# Altium schematic sheet MAX1104_TOP.SCHDOC
size B; Organization: Altium Limited; Address1: L3, 12a Rodborough Rd; Address2: Frenchs Forest; Address3: NSW; Address4: Australia 2086; DocumentNumber: 1; SheetNumber: 1; SheetTotal: 1
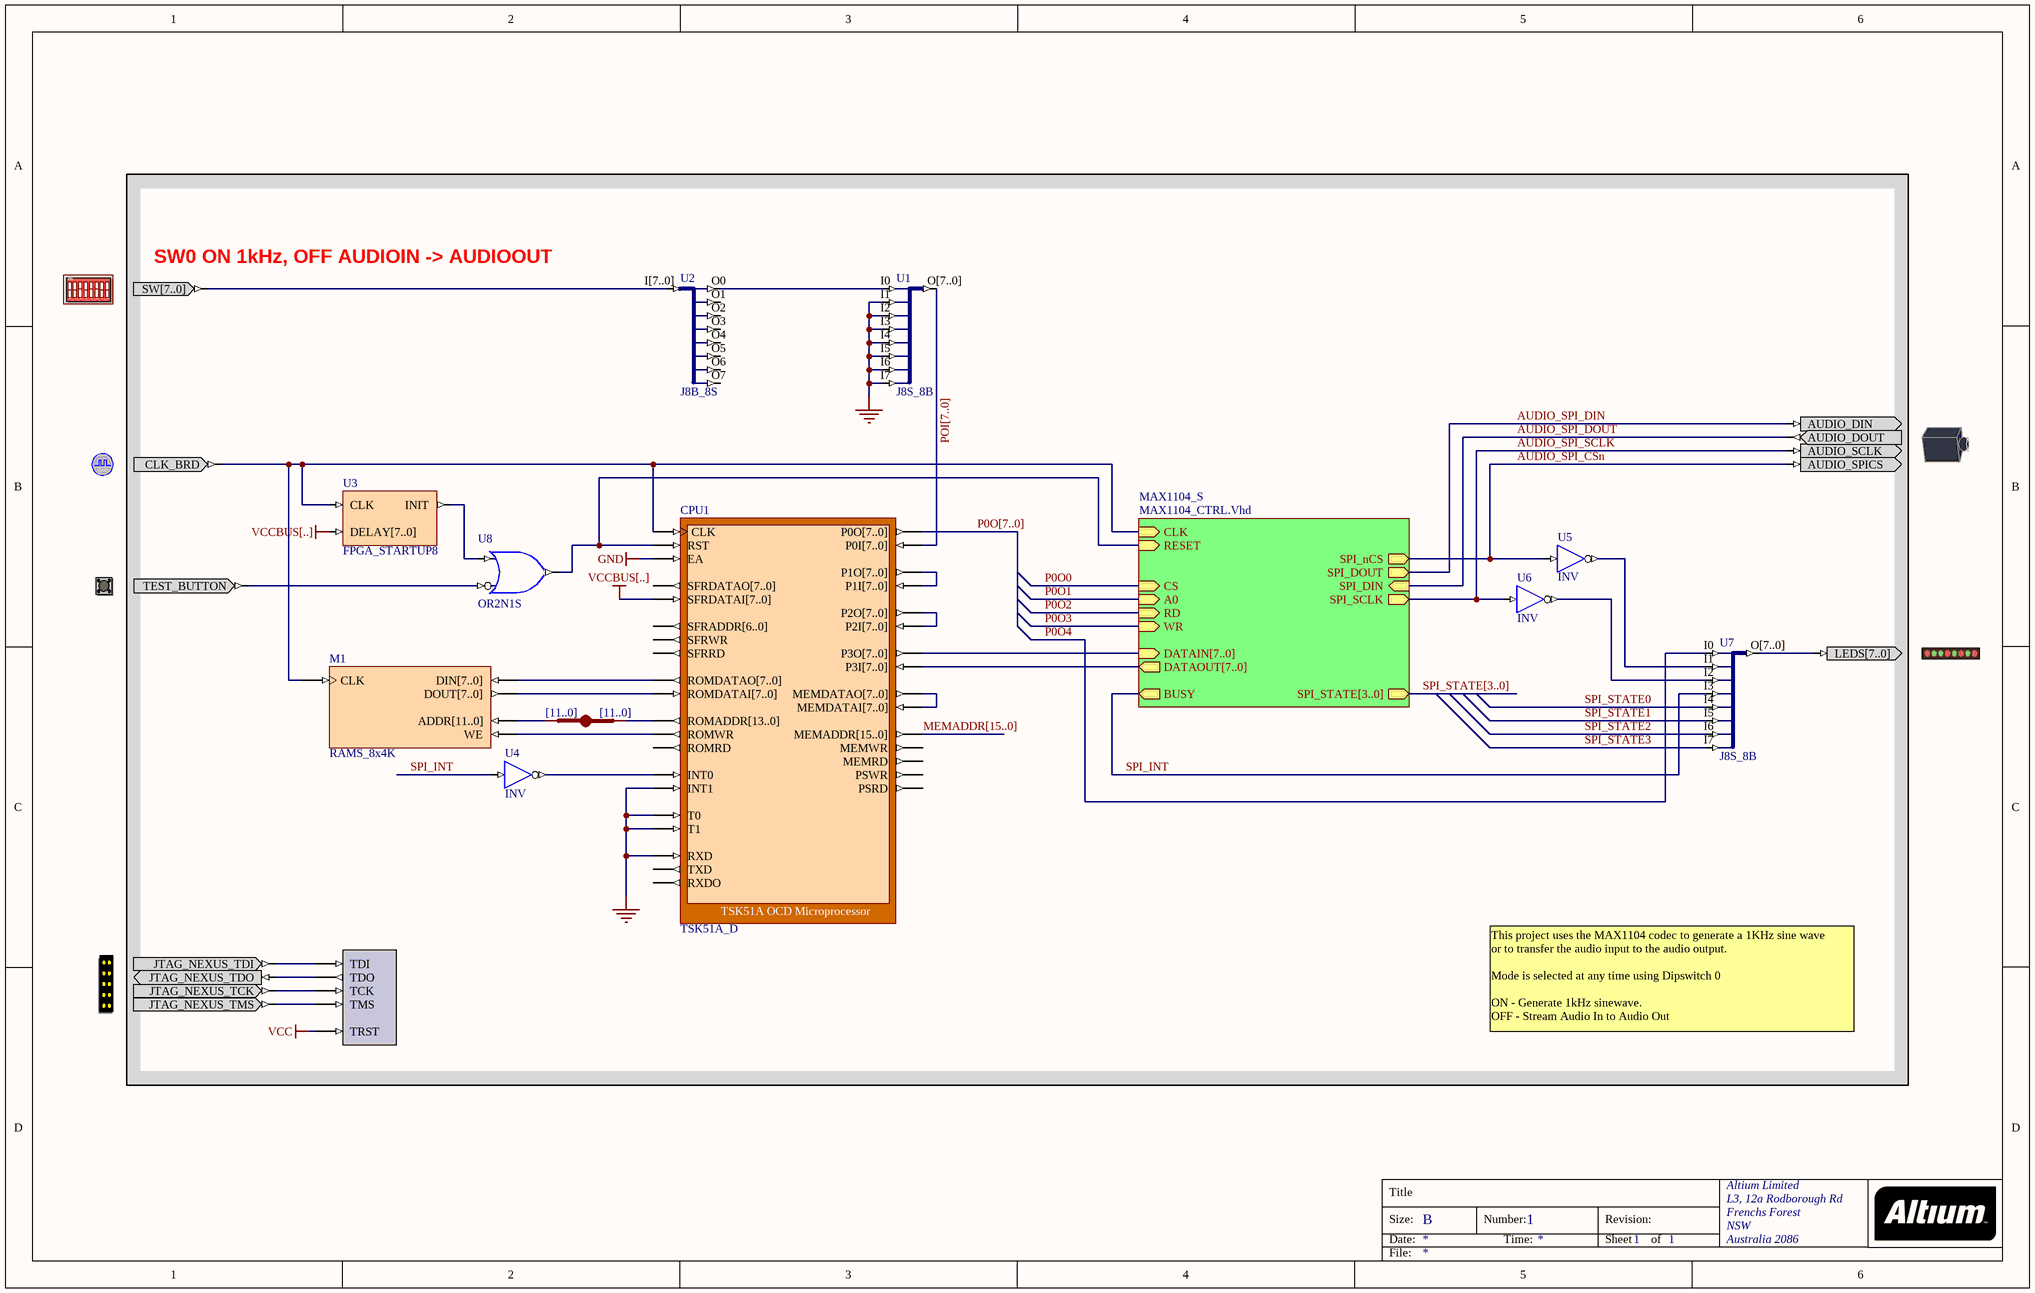
[diagram p0: MAX1104_TOP.SCHDOC]

## Parts
(Parts that share a designator on the sheet are numbered #1, #2 ... from top to bottom, then left to right.)
?#1  DIPSWITCH  (value not drawn)
?#2  CLOCK_BOARD  (value not drawn)
?#3  AUDIO_DAC  (value not drawn)
?#4  TEST_BUTTON  (value not drawn)
?#5  LED  (value not drawn)
?#6  NEXUS_JTAG_CONNECTOR  (value not drawn)
CPU1  TSK51A_D
M1  RAMS_8x4K
NEXUS_JTAG_PORT  NEXUS_JTAG_PORT  (value not drawn)
U1  J8S_8B
U2  J8B_8S
U3  FPGA_STARTUP8
U4  INV
U5  INV
U6  INV
U7  J8S_8B
U8  OR2N1S
U101  IndexA: [11..0]  (hidden comment: JB)

## Blocks framed on the sheet
SW0 ON 1kHz, OFF AUDIOIN -> AUDIOOUT: ?#1-?#6 CPU1 M1 NEXUS_JTAG_PORT U1-U8 U101

## Sub-sheets
MAX1104_S = MAX1104_CTRL.Vhd: DATAIN[7..0] (in), CS (in), BUSY (out), SPI_DOUT (out), SPI_SCLK (out), SPI_nCS (out), SPI_DIN (in), RD (in), WR (in), CLK (in), DATAOUT[7..0] (out), A0 (in), RESET (in), SPI_STATE[3..0] (out)

## Nets
GND: CPU1.EA CPU1.INT1 CPU1.RXD CPU1.T0 CPU1.T1 U1.I1 U1.I2 U1.I3 U1.I4 U1.I5 U1.I6 U1.I7
VCC: NEXUS_JTAG_PORT.TRST
VCCBUS[..]: CPU1.SFRDATAI[7..0] U3.DELAY[7..0]
AUDIO_SPI_CSn: ?#3.AUDIO_SPICS U5.I ; sheet MAX1104_S/SPI_nCS
AUDIO_SPI_DIN: ?#3.AUDIO_DIN ; sheet MAX1104_S/SPI_DOUT
AUDIO_SPI_DOUT: ?#3.AUDIO_DOUT ; sheet MAX1104_S/SPI_DIN
AUDIO_SPI_SCLK: ?#3.AUDIO_SCLK U6.I ; sheet MAX1104_S/SPI_SCLK
MEMADDR[15..0]: CPU1.MEMADDR[15..0]
P0O0: sheet MAX1104_S/CS
P0O1: sheet MAX1104_S/A0
P0O2: sheet MAX1104_S/RD
P0O3: sheet MAX1104_S/WR
P0O4: U7.I0
P0O[7..0]: CPU1.P0O[7..0]
POI[7..0]: CPU1.P0I[7..0] U1.O[7..0]
SPI_INT: U4.I U7.I3 ; sheet MAX1104_S/BUSY
SPI_STATE0: U7.I4
SPI_STATE1: U7.I5
SPI_STATE2: U7.I6
SPI_STATE3: U7.I7
Net?#1_SW[7..0]: ?#1.SW[7..0] U2.I[7..0]
Net?#2_CLK_BRD: ?#2.CLK_BRD CPU1.CLK M1.CLK U3.CLK ; sheet MAX1104_S/CLK
Net?#4_TEST_BUTTON: ?#4.TEST_BUTTON U8.I0
Net?#5_LEDS[7..0]: ?#5.LEDS[7..0] U7.O[7..0]
Net?#6_JTAG_NEXUS_TCK: ?#6.JTAG_NEXUS_TCK NEXUS_JTAG_PORT.TCK
Net?#6_JTAG_NEXUS_TDI: ?#6.JTAG_NEXUS_TDI NEXUS_JTAG_PORT.TDI
Net?#6_JTAG_NEXUS_TDO: ?#6.JTAG_NEXUS_TDO NEXUS_JTAG_PORT.TDO
Net?#6_JTAG_NEXUS_TMS: ?#6.JTAG_NEXUS_TMS NEXUS_JTAG_PORT.TMS
NetCPU1_INT0: CPU1.INT0 U4.O
NetCPU1_MEMDATAI[7..0]: CPU1.MEMDATAI[7..0] CPU1.MEMDATAO[7..0]
NetCPU1_P1I[7..0]: CPU1.P1I[7..0] CPU1.P1O[7..0]
NetCPU1_P2I[7..0]: CPU1.P2I[7..0] CPU1.P2O[7..0]
NetCPU1_P3I[7..0]: CPU1.P3I[7..0] ; sheet MAX1104_S/DATAOUT[7..0]
NetCPU1_P3O[7..0]: CPU1.P3O[7..0] ; sheet MAX1104_S/DATAIN[7..0]
NetCPU1_ROMADDR[13..0]: CPU1.ROMADDR[13..0] U101.B[0..0]
NetCPU1_ROMDATAI[7..0]: CPU1.ROMDATAI[7..0] M1.DOUT[7..0]
NetCPU1_ROMDATAO[7..0]: CPU1.ROMDATAO[7..0] M1.DIN[7..0]
NetCPU1_ROMWR: CPU1.ROMWR M1.WE
NetCPU1_RST: CPU1.RST U8.O ; sheet MAX1104_S/RESET
NetM1_ADDR[11..0]: M1.ADDR[11..0] U101.A[0..0]
NetU1_I0: U1.I0 U2.O0
NetU3_INIT: U3.INIT U8.I1
NetU5_O: U5.O U7.I1
NetU6_O: U6.O U7.I2

Not connected (* = marked no-connect by the designer): CPU1 MEMRD MEMWR PSRD PSWR ROMRD RXDO SFRADDR[6..0] SFRDATAO[7..0] SFRRD SFRWR TXD; U2 O1 O2 O3 O4 O5 O6 O7

## Buses and harness runs
bus MEMADDR[15..0]
bus P0O[7..0]
bus POI[7..0]
bus SPI_STATE[3..0] = sheet MAX1104_S/SPI_STATE[3..0]

## Notes on the sheet
- This project uses the MAX1104 codec to generate a 1KHz sine wave
  or to transfer the audio input to the audio output.
  Mode is selected at any time using Dipswitch 0
  ON - Generate 1kHz sinewave.
  OFF - Stream Audio In to Audio Out
- Title
- Size:
- Date:
- B
- Number:
- Time:
- Revision:
- Sheet
- of
- File:
- (in symbol DIPSWITCH) ON; 1; 2; 3; 4; 5; 6; 7; 8

## Library data of the parts
?#1 = DIPSWITCH: 8-Way Dip Switch; PortComponent: True; Published: 19-Nov-2003; Publisher: Altium Limited
?#2 = CLOCK_BOARD: Global System Clock Supply; PortComponent: True; Published: 19-Nov-2003; Publisher: Altium Limited
?#3 = AUDIO_DAC: Audio Jack; PortComponent: True; Published: 19-Nov-2003; Publisher: Altium Limited
?#4 = TEST_BUTTON: Test Button; PortComponent: True; Published: 19-Nov-2003; Publisher: Altium Limited
?#5 = LED: 8-Way LEDS; PortComponent: True; Published: 19-Nov-2003; Publisher: Altium Limited
?#6 = NEXUS_JTAG_CONNECTOR: JTAG Port; PortComponent: True; Published: 19-Nov-2003; Publisher: Altium Limited
CPU1 = TSK51A_D: TSK51A OCD Microprocessor; NEXUS_CORE: Processor_OCDS; NEXUS_JTAG_DEVICE: True; NEXUS_JTAG_ORDER: 0; ChildModel1: RAM256x8_TSK51D; ChildCore1: M1; Published: 23/10/2003; Publisher: Altium Hobart Technology Centre; Core Revision: 1.00.00
M1 = RAMS_8x4K: Single Port Random Access Memory; Memory_Depth: 4096; Memory_Type: RAM_SinglePortBlock; Memory_Width: 8; Memory_ClockEdge: Rising; Nexus_Core: Memory_Program; Published: 13/01/2004; Publisher: Altium Hobart Technology Center
NEXUS_JTAG_PORT = NEXUS_JTAG_PORT: Nexus Processor JTAG Chain Connector; NEXUS_JTAG_CONNECTOR: True; Published: 5-Sep-2003; Publisher: Altium Hobart Technology Centre
U1 U7 = J8S_8B: 8 Single pin inputs to single 8-Bit output bus; ArchiveName: GENERIC; Published: 18-Dec-2003; Publisher: Altium Limited; Core Revision: 1.00.00
U2 = J8B_8S: 8-Bit input bus to 8 single pin outputs; ArchiveName: GENERIC; Published: 18-Dec-2003; Publisher: Altium Limited; Core Revision: 1.00.00
U3 = FPGA_STARTUP8: FPGA Startup With 8 Bit Delay; Published: 21/01/2004; Publisher: Altium Hobart Technology Centre; Core Revision: 1.00.00
U4 = INV: Inverter; Class I: Logic Primitive; ArchiveName: GENERIC; Published: 18-Sep-2003; Publisher: Altium Limited; Xilinx Equivalent: INV
U5 U6 = INV: Inverter; ArchiveName: GENERIC; Published: 7-Nov-2003; Publisher: Altium Limited; Xilinx Equivalent: INV; Core Revision: 1.00.00
U8 = OR2N1S: 2-Input OR Gate with Active Low A Input, Single Pin Version; Xilinx Equivalent: OR2B1; ArchiveName: GENERIC; Published: 18-Dec-2003; Publisher: Altium Limited; Core Revision: 1.00.00
U101 = JB: System Joiner; Class I: Bus Joiner; ArchiveName: GENERIC; Published: 18-Sep-2003; Publisher: Altium Limited; IndexB: [11..0]